# EAGLE board OpenROV Controller 2.8 (EAGLE 6.4), part 1 of 2
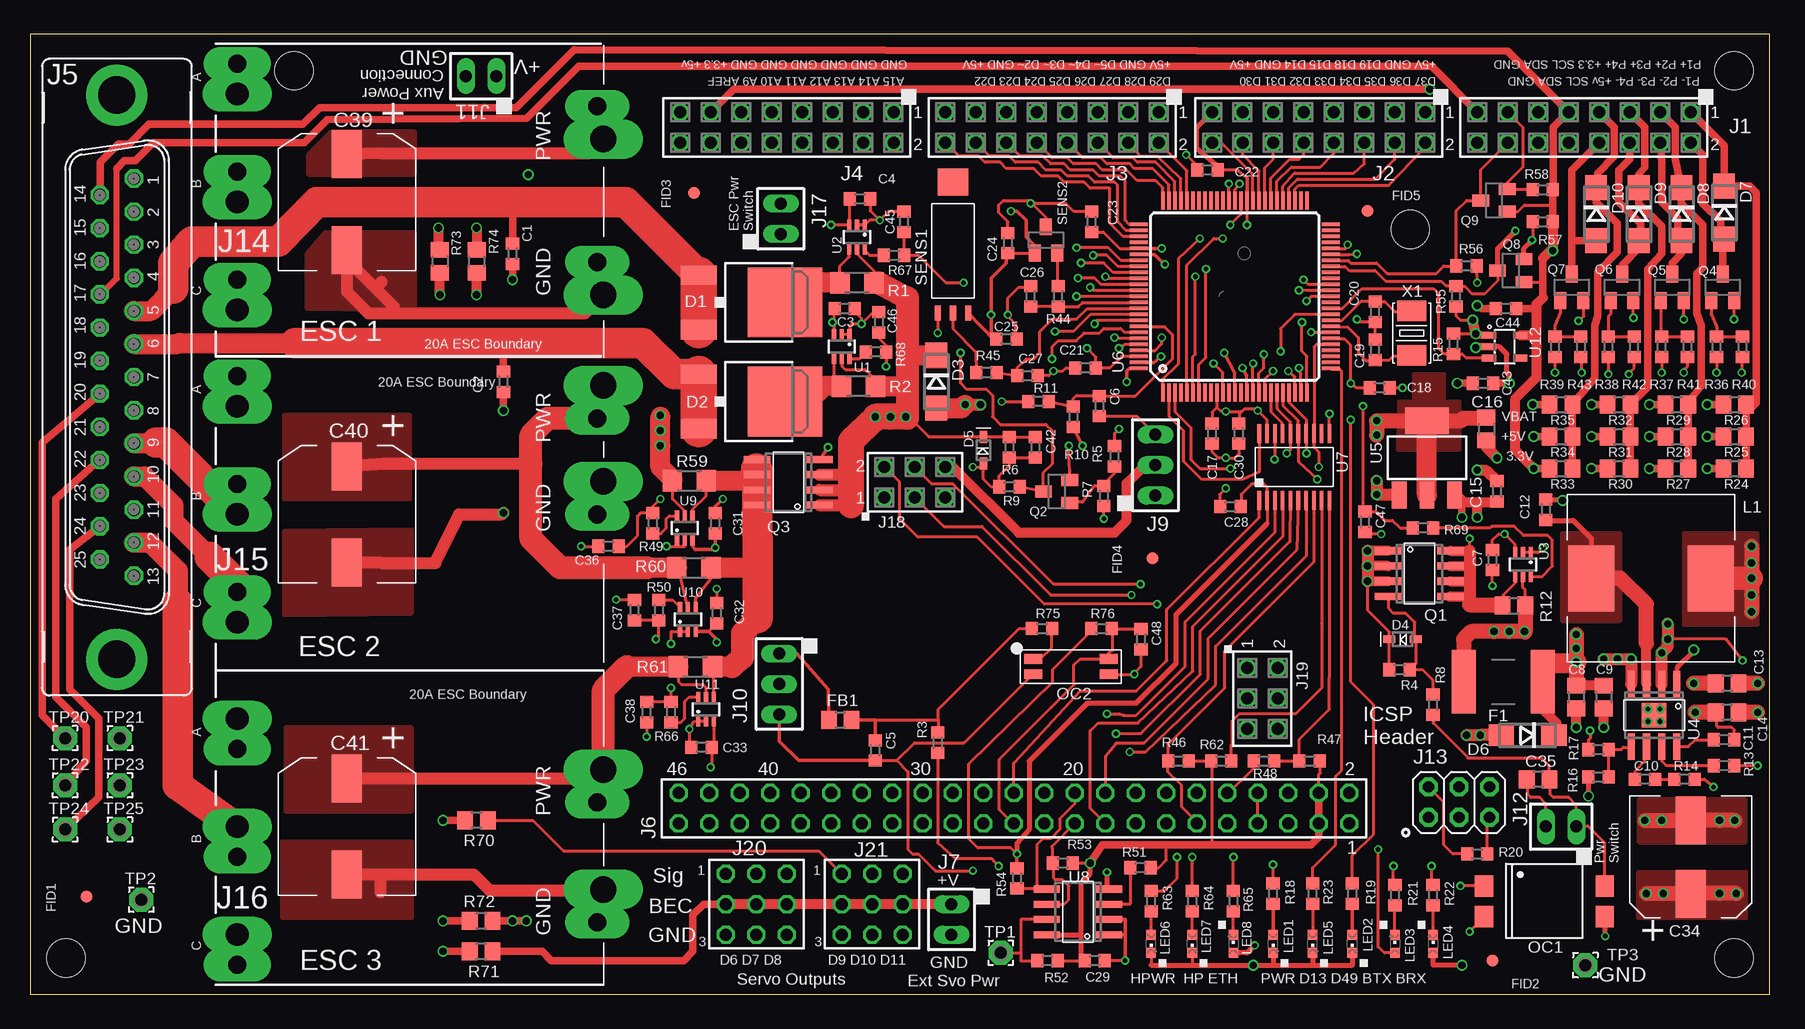
[diagram p8: board, top side]
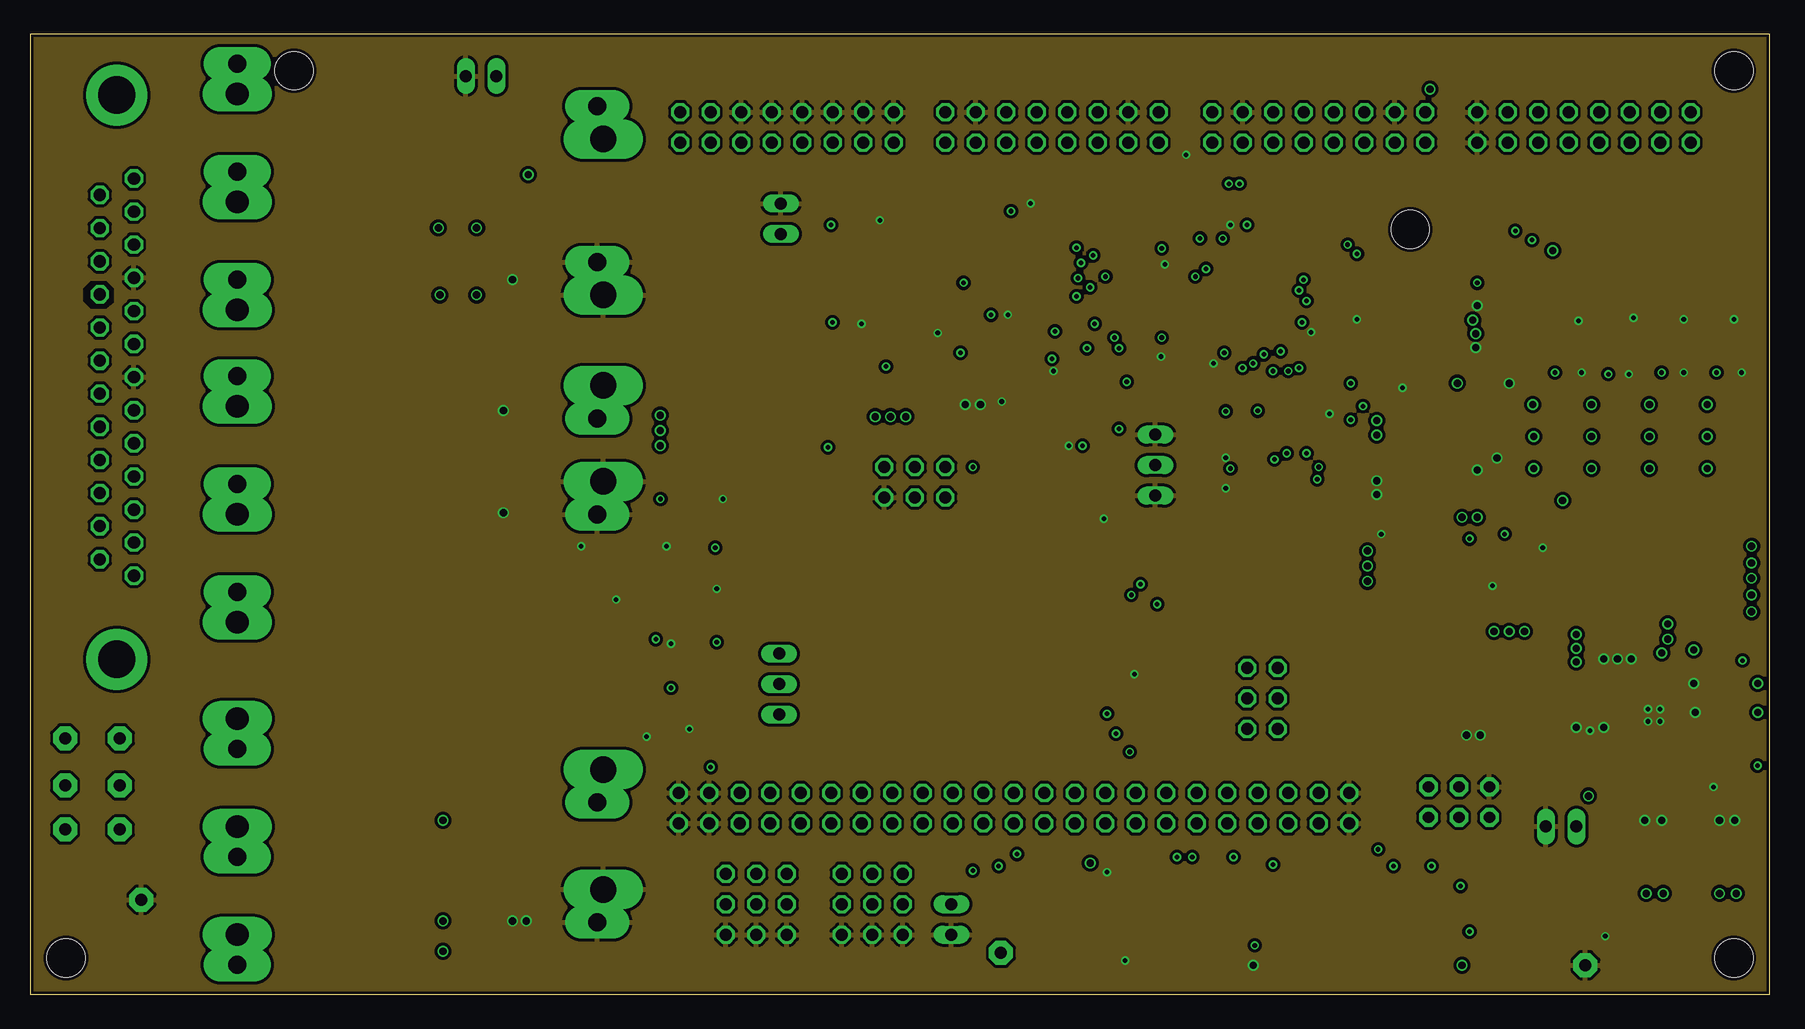
[diagram p9: board, inner layer Route2]
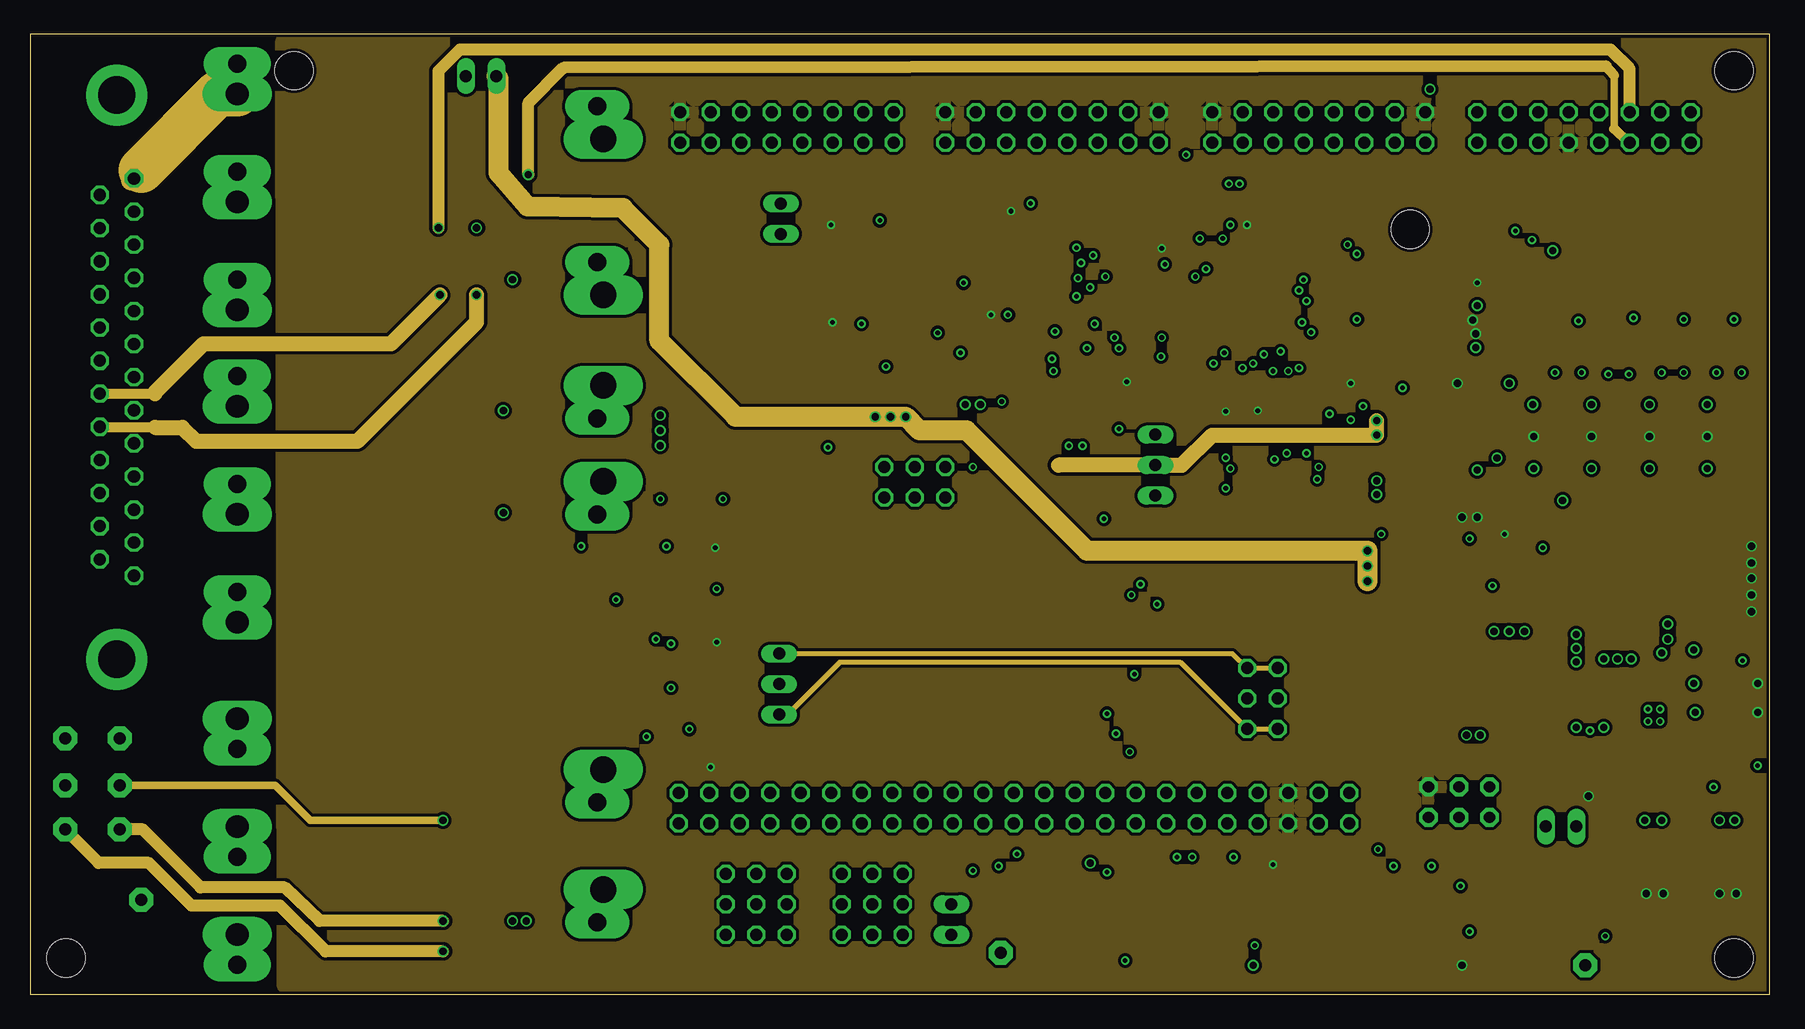
[diagram p10: board, inner layer Route15]
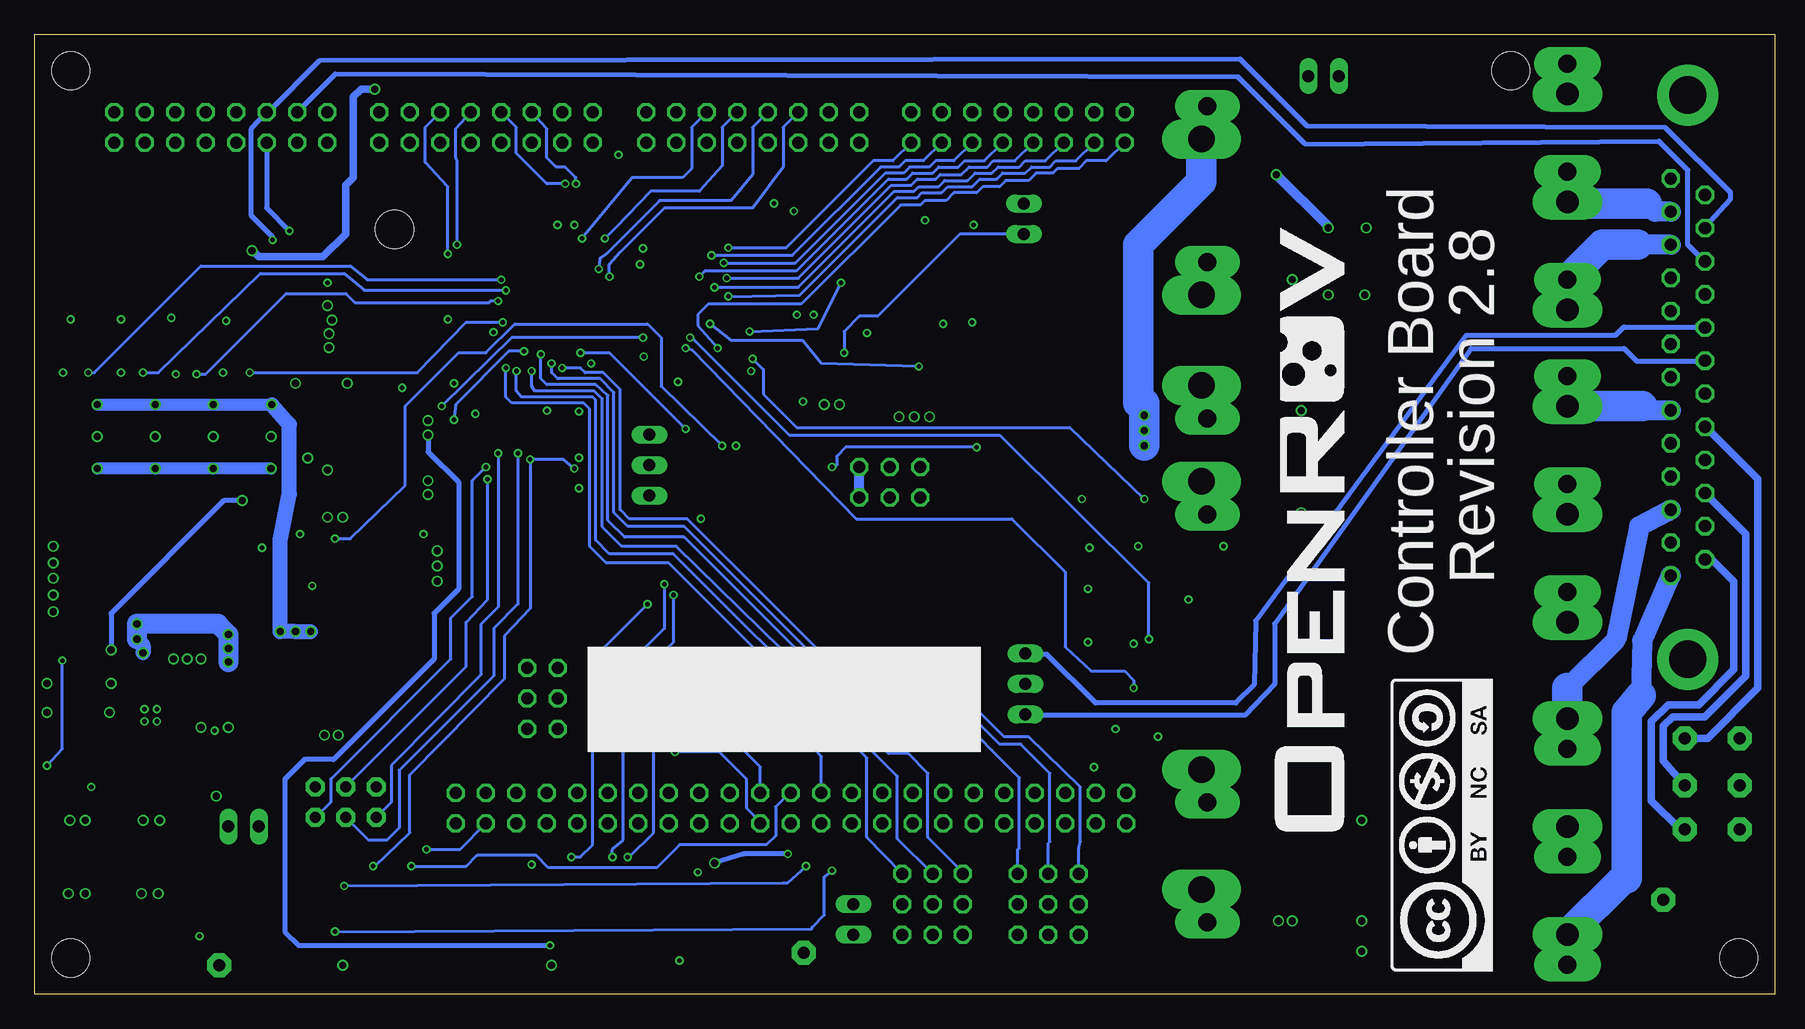
[diagram p11: board, bottom side, seen from below]

Size 144.99 x 80.01 mm. Coordinates in mm from the lower left corner, seen from the top.
Outline: 0,0 144.99,0 144.99,80.01 0,80.01 0,0
Copper layers (1*2*15*16): Top 0.035mm / dielectric 0.2mm / Route2 0.0175mm / dielectric 1.1mm / Route15 0.0175mm / dielectric 0.2mm / Bottom 0.035mm
Design rules "SeeedStudio_DRU_no_angle_20130527": minimum track width 6mil, minimum drill 12mil, track to track 6mil, track to pad 6mil, pad to pad 6mil, via to via 6mil, smd to smd 0mil, copper to edge 10mil, drill to drill 10mil, minimum pad ring 6mil, minimum via ring 6mil, stop-mask expansion 2mil, vias tented up to drill 25mil, thermal gap 10mil
Holes 3.17 mm at 3,3 141.99,3 115.02,63.75 141.99,76.99 22,76.99
tKeepout: area 139.2,0.2 to 144.8,5.8; area 139.2,74.2 to 144.8,79.8; area 19.2,74.2 to 24.8,79.8; area 112.2,61 to 117.8,66.5

## Footprints (pad centres in the part's own frame; a part is rotated, then mirrored left to right if it is on the bottom)
R0603 = smd 1 x 1.1: 1 -0.85,0; 2 0.85,0
R0805 = smd 1.3 x 1.5: 1 -0.95,0; 2 0.95,0
NICHICON_8MM = smd 4 x 2.5: + 3.05,0; - -3.05,0
NICHICON_10MM = smd 4 x 2.5: + 4,0; - -4,0
DPAK = smd 1.6 x 3: 1 -2.28,-4.04; 3 2.28,-4.04 | smd 5.8 x 6.2: 4 0,3.14
DO214AC = smd 2.1 x 1.8: A 2.2,0; C -2.2,0
SOD323 = smd 1 x 0.6: A 1.1,0; C -1.1,0
R2920 = smd 2 x 5.3: 1 -3.3,0; 2 3.3,0
FIDUCIAL_1 = smd 1.016 x 1.016: P$1 0,0
SSW-108-02-S-D = drill 1 pad 1.5 octagon: 1 -8.89,-1.27; 2 -8.89,1.27; 3 -6.35,-1.27; 4 -6.35,1.27; 5 -3.81,-1.27; 6 -3.81,1.27; 7 -1.27,-1.27; 8 -1.27,1.27; 9 1.27,-1.27; 10 1.27,1.27; 11 3.81,-1.27; 12 3.81,1.27; 13 6.35,-1.27; 14 6.35,1.27; 15 8.89,-1.27; 16 8.89,1.27
M25VP = drill 1.016 octagon: 1 -16.561,1.422; 2 -13.792,1.422; 3 -11.049,1.422; 4 -8.28,1.422; 5 -5.512,1.422; 6 -2.769,1.422; 7 0,1.422; 8 2.769,1.422; 9 5.512,1.422; 10 8.28,1.422; 11 11.049,1.422; 12 13.792,1.422; 13 16.561,1.422; 14 -15.189,-1.422; 15 -12.421,-1.422; 16 -9.652,-1.422; 17 -6.909,-1.422; 18 -4.14,-1.422; 19 -1.372,-1.422; 20 1.372,-1.422; 21 4.14,-1.422; 22 6.909,-1.422; 23 9.652,-1.422; 24 12.421,-1.422; 25 15.189,-1.422 | drill 3.1 pad 5.08: G1 -23.52,0; G2 23.52,0
TSW-123-02-S-D = drill 1 pad 1.5 octagon: 1 27.94,-1.27; 2 27.94,1.27; 3 25.4,-1.27; 4 25.4,1.27; 5 22.86,-1.27; 6 22.86,1.27; 7 20.32,-1.27; 8 20.32,1.27; 9 17.78,-1.27; 10 17.78,1.27; 11 15.24,-1.27; 12 15.24,1.27; 13 12.7,-1.27; 14 12.7,1.27; 15 10.16,-1.27; 16 10.16,1.27; 17 7.62,-1.27; 18 7.62,1.27; 19 5.08,-1.27; 20 5.08,1.27; 21 2.54,-1.27; 22 2.54,1.27; 23 0,-1.27; 24 0,1.27; 25 -2.54,-1.27; 26 -2.54,1.27; 27 -5.08,-1.27; 28 -5.08,1.27; 29 -7.62,-1.27; 30 -7.62,1.27; 31 -10.16,-1.27; 32 -10.16,1.27; 33 -12.7,-1.27; 34 -12.7,1.27; 35 -15.24,-1.27; 36 -15.24,1.27; 37 -17.78,-1.27; 38 -17.78,1.27; 39 -20.32,-1.27; 40 -20.32,1.27; 41 -22.86,-1.27; 42 -22.86,1.27; 43 -25.4,-1.27; 44 -25.4,1.27; 45 -27.94,-1.27; 46 -27.94,1.27
22-23-2021_ALT_SILK = drill 1 long: 1 -1.27,0; 2 1.27,0
22-23-2031_ALT_SILK = drill 1 long: 1 -2.54,0; 2 0,0; 3 2.54,0
HDR_PINS_2X3 = drill 0.95 pad 1.55 octagon: 1 -2.54,-1.27; 2 -2.54,1.27; 3 0,-1.27; 4 0,1.27; 5 2.54,-1.27; 6 2.54,1.27
AFRO-ESC-12/20A-ESC1S = drill 1.9 pad 2.9 long: A1 9,0; B1 0,0; C1 -9,0 | drill 1.5 pad 2.8 long: A2 11.54,0; B2 2.54,0; C2 -6.46,0 | drill 2.2 pad 3.3 long: GND1 -7.75,-30.5; PWR1 5.25,-30.5 | drill 1.5 pad 2.7 long: GND2 -5,-30; PWR2 8,-30
AFRO-ESC-12/20A-ESC2S = drill 1.9 pad 2.9 long: A1 9,0; B1 0,0; C1 -9,0 | drill 1.5 pad 2.8 long: A2 11.54,0; B2 2.54,0; C2 -6.46,0 | drill 2.2 pad 3.3 long: GND1 2.75,-30.5; PWR1 10.75,-30.5 | drill 1.5 pad 2.7 long: GND2 0,-30; PWR2 8,-30
AFRO-ESC-12/20A-ESC3S = drill 1.9 pad 2.9 long: A1 9,0; B1 0,0; C1 -9,0 | drill 1.5 pad 2.8 long: A2 6.46,0; B2 -2.54,0; C2 -11.54,0 | drill 2.2 pad 3.3 long: GND1 -5.25,-30.5; PWR1 4.75,-30.5 | drill 1.5 pad 2.7 long: GND2 -8,-30; PWR2 2,-30
SSW-103-02-S-D = drill 1 pad 1.5 octagon: 1 -2.54,-1.27; 2 -2.54,1.27; 3 0,-1.27; 4 0,1.27; 5 2.54,-1.27; 6 2.54,1.27
HDR_PINS_3X3 = drill 1 pad 1.5 octagon: P1 2.54,-2.54; P2 2.54,0; P3 2.54,2.54; P4 0,-2.54; P5 0,0; P6 0,2.54; P7 -2.54,-2.54; P8 -2.54,0; P9 -2.54,2.54
INDUCTOR_BOURNS_12X0 = smd 3.85 x 5.5: 1 -4.975,0; 2 4.975,0
LED_CHIPLED_0603 = smd 0.8 x 0.8: A 0,-0.75; C 0,0.75
DIL4-SMD = smd 1.78 x 1.52: 1 -2.54,-5.029; 2 0,-5.029; 3 0,5.029; 4 -2.54,5.029
OPTOCOUPLER-MINIFLAT-HALFPITCH = smd 1.5 x 0.8: 1 -3.15,0.635; 2 -3.15,-0.635; 3 3.15,-0.635; 4 3.15,0.635
SO8 = smd 0.6 x 2.2: 1 -1.905,-2.6; 2 -0.635,-2.6; 3 0.635,-2.6; 4 1.905,-2.6; 5 1.905,2.6; 6 0.635,2.6; 7 -0.635,2.6; 8 -1.905,2.6
SOT23 = smd 1 x 1.4: 1 -0.95,-1.1; 2 0.95,-1.1; 3 0,1.1
R1206 = smd 1.6 x 1.803: 1 -1.422,0; 2 1.422,0
HIH-5031 = smd 0.508 x 1.27: 1 -1.27,0; 2 0,0; 3 1.27,0 | smd 2.54 x 2.286: PAD 0,10.922
2.0/1.0 = drill 1 pad 2 octagon: 1 0,0
SC70-6L = smd 0.35 x 0.9: 1 -0.65,-1; 2 0,-1; 3 0.65,-1; 4 0.65,1; 5 0,1; 6 -0.65,1
SO8-THERMAL = smd 0.6 x 2.2: 1 -1.905,-2.6; 2 -0.635,-2.6; 3 0.635,-2.6; 4 1.905,-2.6; 5 1.905,2.6; 6 0.635,2.6; 7 -0.635,2.6; 8 -1.905,2.6 | smd 2.032 x 2.032: PAD 0,0
SOT223 = smd 1.219 x 2.235: 1 -2.311,-3.099; 2 0,-3.099; 3 2.311,-3.099 | smd 3.6 x 2.2: 4 0,3.099
SMARTPRJ_TQFP100 = smd 1.5 x 0.3: 1 -8,6; 2 -8,5.5; 3 -8,5; 4 -8,4.5; 5 -8,4; 6 -8,3.5; 7 -8,3; 8 -8,2.5; 9 -8,2; 10 -8,1.5; 11 -8,1; 12 -8,0.5; 13 -8,0; 14 -8,-0.5; 15 -8,-1; 16 -8,-1.5; 17 -8,-2; 18 -8,-2.5; 19 -8,-3; 20 -8,-3.5; 21 -8,-4; 22 -8,-4.5; 23 -8,-5; 24 -8,-5.5; 25 -8,-6; 51 8,-6; 52 8,-5.5; 53 8,-5; 54 8,-4.5; 55 8,-4; 56 8,-3.5; 57 8,-3; 58 8,-2.5; 59 8,-2; 60 8,-1.5; 61 8,-1; 62 8,-0.5; 63 8,0; 64 8,0.5; 65 8,1; 66 8,1.5; 67 8,2; 68 8,2.5; 69 8,3; 70 8,3.5; 71 8,4; 72 8,4.5; 73 8,5; 74 8,5.5; 75 8,6 | smd 0.3 x 1.5: 26 -6,-8; 27 -5.5,-8; 28 -5,-8; 29 -4.5,-8; 30 -4,-8; 31 -3.5,-8; 32 -3,-8; 33 -2.5,-8; 34 -2,-8; 35 -1.5,-8; 36 -1,-8; 37 -0.5,-8; 38 0,-8; 39 0.5,-8; 40 1,-8; 41 1.5,-8; 42 2,-8; 43 2.5,-8; 44 3,-8; 45 3.5,-8; 46 4,-8; 47 4.5,-8; 48 5,-8; 49 5.5,-8; 50 6,-8; 76 6,8; 77 5.5,8; 78 5,8; 79 4.5,8; 80 4,8; 81 3.5,8; 82 3,8; 83 2.5,8; 84 2,8; 85 1.5,8; 86 1,8; 87 0.5,8; 88 0,8; 89 -0.5,8; 90 -1,8; 91 -1.5,8; 92 -2,8; 93 -2.5,8; 94 -3,8; 95 -3.5,8; 96 -4,8; 97 -4.5,8; 98 -5,8; 99 -5.5,8; 100 -6,8
SSOP-20 = smd 0.3 x 1.6: 1 -2.925,-2.8; 2 -2.275,-2.8; 3 -1.625,-2.8; 4 -0.975,-2.8; 5 -0.325,-2.8; 6 0.325,-2.8; 7 0.975,-2.8; 8 1.625,-2.8; 9 2.275,-2.8; 10 2.925,-2.8; 11 2.925,2.8; 12 2.275,2.8; 13 1.625,2.8; 14 0.975,2.8; 15 0.325,2.8; 16 -0.325,2.8; 17 -0.975,2.8; 18 -1.625,2.8; 19 -2.275,2.8; 20 -2.925,2.8
SOT23-5L = smd 0.55 x 1.2: 1 -0.95,-1.3; 2 0,-1.3; 3 0.95,-1.3; 4 0.95,1.3; 5 -0.95,1.3
DISCRETE_2P-SMD-5X3.2 = smd 1.7 x 2.4: 1 -1.85,0; 2 1.85,0

## Placement (x,y rotation side)
C1  0.1 uF  [R0603]  40.21,61.72 270 top
C2  0.1 uF  [R0603]  39.45,51.05 270 top
C3  0.1 uF  [R0603]  67.9,57.15 0 top
C4  0.1 uF  [R0603]  69.17,66.29 0 top
C5  0.1 uF  [R0603]  70.44,20.32 270 top
C6  0.1 uF  [R0603]  89.11,49.02 270 top
C7  0.1 uF  [R0603]  121.87,36.2 270 top
C8  10 uF 25V X5R  [R0805]  128.86,24.77 270 top
C9  10 uF 25V X5R  [R0805]  131.14,24.77 270 top
C10  3900 pF 25V NP0  [R0603]  134.57,17.91 0 top
C11  3900 pF 25V NP0  [R0603]  141.18,21.21 0 top
C12  0.1 uF  [R0603]  126.32,40.39 270 top
C13  22 uF 10V X5R  [R0805]  141.43,25.91 180 top
C14  22 uF 10V X5R  [R0805]  141.43,23.5 180 top
C15  0.1 uF  [R0603]  122.25,41.91 90 top
C16  10 uF 25V X5R  [R0805]  121.36,47.12 270 top
C17  0.1 uF  [R0603]  98.5,46.74 270 top
C18  0.1 uF  [R0603]  112.47,50.55 0 top
C19  12 pF  [R0603]  112.09,53.72 90 top
C20  12 pF  [R0603]  112.09,56.9 270 top
C21  0.1 uF  [R0603]  87.96,52.2 180 top
C22  0.1 uF  [R0603]  98.12,68.71 180 top
C23  0.1 uF  [R0603]  88.47,64.39 90 top
C24  0.1 uF  [R0603]  81.49,62.61 90 top
C25  0.1 uF  [R0603]  81.36,54.61 0 top
C26  0.1 uF  [R0603]  83.39,58.17 90 top
C27  0.1 uF  [R0603]  83.14,51.56 0 top
C28  0.1 uF  [R0603]  100.03,40.64 180 top
C29  0.1 uF  [R0603]  88.73,2.79 0 top
C30  0.1 uF  [R0603]  100.73,46.74 270 top
C31  0.1 uF  [R0603]  57.1,39.24 90 top
C32  0.1 uF  [R0603]  57.23,31.75 90 top
C33  0.1 uF  [R0603]  55.96,20.57 180 top
C34  220 uF 10V  [NICHICON_8MM]  138.38,11.43 270 top
C35  10 uF 25V X5R  [R0805]  125.68,17.91 180 top
C36  1 uF 25V X7R  [R0603]  48.21,37.34 180 top
C37  1 uF 25V X7R  [R0603]  50.37,32 90 top
C38  1 uF 25V X7R  [R0603]  51.39,23.5 270 top
C39  220 uF 35V Low-Impedance  [NICHICON_10MM]  26.42,66.04 90 top
C40  220 uF 35V Low-Impedance  [NICHICON_10MM]  26.42,40.01 90 top
C41  220 uF 35V Low-Impedance  [NICHICON_10MM]  26.42,13.97 90 top
C42  1 uF 25V X7R  [R0603]  83.77,45.59 270 top
C43  0.1 uF  [R0603]  121.08,50.93 0 top
C44  1 uF 25V X7R  [R0603]  123.02,57.15 180 top
C45  1 uF 25V X7R  [R0603]  72.83,64.39 90 top
C46  1 uF 25V X7R  [R0603]  70.74,56.01 90 top
C47  1 uF 25V X7R  [R0603]  111.25,39.37 270 top
C48  1 uF 25V X7R  [R0603]  92.58,29.59 270 top
D1  MBRD835L  [DPAK]  59.77,57.66 270 top
D2  MBRD835L  [DPAK]  59.77,49.4 270 top
D3  SMAJ18A  [DO214AC]  75.52,51.05 270 top
D4  16.18V 2%  [SOD323]  114.38,29.59 0 top
D5  16.18V 2%  [SOD323]  79.45,45.34 270 top
D6  SMAJ15A  [DO214AC]  124.79,21.59 180 top
D7  S1A  [DO214AC]  141.18,65.15 270 top
D8  S1A  [DO214AC]  137.62,65.02 270 top
D9  S1A  [DO214AC]  134.06,65.02 270 top
D10  S1A  [DO214AC]  130.51,65.02 270 top
F1  2.0A / 4.0A 24V  [R2920]  122.76,26.04 0 top
FB1  HZ0805B272R-10  [R0805]  67.52,22.86 0 top
FID1  FIDUCIAL_1  [FIDUCIAL_1]  4.7,8.13 0 top
FID2  FIDUCIAL_1  [FIDUCIAL_1]  121.87,2.79 0 top
FID3  FIDUCIAL_1  [FIDUCIAL_1]  55.33,66.8 0 top
FID4  FIDUCIAL_1  [FIDUCIAL_1]  93.55,36.32 0 top
FID5  FIDUCIAL_1  [FIDUCIAL_1]  111.46,65.28 0 top
J1  Sullins PPPC082LFBN-RC  [SSW-108-02-S-D]  129.49,72.26 180 top
J2  PPPC082LFBN-RC (Not populated)  [SSW-108-02-S-D]  107.39,72.26 180 top
J3  PPPC082LFBN-RC (Not populated)  [SSW-108-02-S-D]  85.17,72.26 180 top
J4  PPPC082LFBN-RC (Not populated)  [SSW-108-02-S-D]  63.07,72.26 180 top
J5  Norcomp 182-025-113R531  [M25VP]  7.24,51.44 270 top
J6  Samtec DW-23-11-G-D-630  [TSW-123-02-S-D]  82,15.49 0 top
J7  [22-23-2021_ALT_SILK]  76.79,6.22 270 top
J9  [22-23-2031_ALT_SILK]  93.78,44.09 90 top
J10  [22-23-2031_ALT_SILK]  62.44,25.86 270 top
J11  [22-23-2021_ALT_SILK]  37.59,76.53 180 top
J12  [22-23-2021_ALT_SILK]  127.59,13.97 180 top
J13  [HDR_PINS_2X3]  119.08,16 0 top
J14  [AFRO-ESC-12/20A-ESC1S]  17.27,66.04 90 top
J15  [AFRO-ESC-12/20A-ESC2S]  17.27,40.01 90 top
J16  [AFRO-ESC-12/20A-ESC3S]  17.27,13.97 90 top
J17  [22-23-2021_ALT_SILK]  62.56,64.64 90 top
J18  Sullins PRPC003DFAN-RC  [SSW-103-02-S-D]  73.74,42.67 0 top
J19  Sullins PRPC003DFAN-RC  [SSW-103-02-S-D]  102.7,24.64 270 top
J20  TSW-103-07-G-T  [HDR_PINS_3X3]  60.53,7.49 180 top
J21  TSW-103-07-G-T  [HDR_PINS_3X3]  70.18,7.49 180 top
L1  15 uH 4A  [INDUCTOR_BOURNS_12X0]  135.08,34.67 0 top
LED1  GREEN  [LED_CHIPLED_0603]  103.58,4.19 180 top
LED2  RED  [LED_CHIPLED_0603]  110.19,4.19 180 top
LED3  YELLOW  [LED_CHIPLED_0603]  113.75,4.19 0 top
LED4  YELLOW  [LED_CHIPLED_0603]  116.92,4.19 0 top
LED5  RED  [LED_CHIPLED_0603]  106.89,4.19 180 top
LED6  GREEN  [LED_CHIPLED_0603]  93.42,4.19 180 top
LED7  YELLOW  [LED_CHIPLED_0603]  96.85,4.19 180 top
LED8  YELLOW  [LED_CHIPLED_0603]  100.28,4.19 0 top
OC1  LTV-8141S  [DIL4-SMD]  126.19,6.48 270 top
OC2  PC3H411NIP0F  [OPTOCOUPLER-MINIFLAT-HALFPITCH]  86.74,27.3 0 top
Q1  SI4485  [SO8]  115.78,35.05 270 top
Q2  DMN65D8L  [SOT23]  85.55,41.91 90 top
Q3  SI4459ADY  [SO8]  63.2,42.67 90 top
Q4  IRLML6346TR  [SOT23]  141.05,58.93 0 top
Q5  IRLML6346TR  [SOT23]  136.86,58.93 0 top
Q6  IRLML6346TR  [SOT23]  132.67,58.93 0 top
Q7  IRLML6346TR  [SOT23]  128.48,58.93 0 top
Q8  FDV301N  [SOT23]  123.4,60.33 90 top
Q9  FDV301N  [SOT23]  122,66.17 90 top
R1  0.005 1%  [R1206]  68.91,59.31 0 top
R2  0.005 1%  [R1206]  69.04,50.67 0 top
R3  18K  [R0603]  75.64,20.95 90 top
R4  30.1K 1%  [R0603]  114.13,27.05 180 top
R5  1K  [R0603]  90.38,44.83 90 top
R6  10K  [R0603]  81.61,45.59 90 top
R7  10K  [R0603]  89.49,41.53 270 top
R8  1K  [R0603]  116.92,24.13 90 top
R9  1K  [R0603]  81.61,42.29 180 top
R10  30.1K 1%  [R0603]  86.95,48.13 90 top
R11  10.0K 1%  [R0603]  84.03,49.4 180 top
R12  0.025 1%  [R0805]  123.65,32.38 0 top
R13  100K  [R0603]  141.18,19.05 180 top
R14  13.0K 1%  [R0603]  137.88,17.91 180 top
R15  10K  [R0603]  118.62,54.23 90 top
R16  45.3K 1%  [R0603]  130.7,18.1 180 top
R17  10.0K 1%  [R0603]  130.7,20.38 0 top
R18  1K  [R0603]  103.58,8.38 270 top
R19  1K  [R0603]  110.19,8.38 270 top
R20  100K  [R0603]  120.6,11.68 0 top
R21  470  [R0603]  113.75,8.26 90 top
R22  1K  [R0603]  116.92,8.26 90 top
R23  1K  [R0603]  106.89,8.38 270 top
R24  DNP  [R0805]  142.07,43.81 0 top
R25  DNP  [R0805]  142.07,46.48 0 top
R26  0 (Jumper)  [R0805]  142.07,49.15 0 top
R27  DNP  [R0805]  137.24,43.81 0 top
R28  0 (Jumper)  [R0805]  137.24,46.48 0 top
R29  DNP  [R0805]  137.24,49.15 0 top
R30  DNP  [R0805]  132.41,43.81 0 top
R31  DNP  [R0805]  132.41,46.48 0 top
R32  0 (Jumper)  [R0805]  132.41,49.15 0 top
R33  DNP  [R0805]  127.59,43.81 0 top
R34  DNP  [R0805]  127.59,46.48 0 top
R35  DNP  [R0805]  127.59,49.15 0 top
R36  1K  [R0603]  140.54,53.98 90 top
R37  1K  [R0603]  135.97,53.98 90 top
R38  1K  [R0603]  131.53,53.98 90 top
R39  1K  [R0603]  127.08,53.98 90 top
R40  10K  [R0603]  142.7,53.98 90 top
R41  10K  [R0603]  138.13,53.98 90 top
R42  10K  [R0603]  133.68,53.98 90 top
R43  10K  [R0603]  129.24,53.98 90 top
R44  10K  [R0603]  85.68,58.17 270 top
R45  10K  [R0603]  79.71,51.82 0 top
R46  1K  [R0603]  95.71,19.43 0 top
R47  DNP  [R0603]  106.63,19.43 0 top
R48  0 (Jumper)  [R0603]  102.82,19.43 180 top
R49  3.3K  [R0603]  51.9,39.24 90 top
R50  3.3K  [R0603]  52.4,32 270 top
R51  4.7K  [R0603]  92.54,10.54 0 top
R52  4.7K  [R0603]  84.79,2.79 0 top
R53  4.7K  [R0603]  86.06,10.92 0 top
R54  4.7K  [R0603]  82.25,9.65 90 top
R55  4.7K  [R0603]  118.83,58.17 270 top
R56  4.7K  [R0603]  119.71,60.71 0 top
R57  4.7K  [R0603]  126.06,64.39 0 top
R58  4.7K  [R0603]  126.06,67.06 0 top
R59  0.005 1%  [R1206]  54.94,42.8 180 top
R60  0.005 1%  [R1206]  55.33,35.56 180 top
R61  0.005 1%  [R1206]  55.45,27.3 180 top
R62  10K  [R0603]  99.27,19.43 180 top
R63  120  [R0603]  93.42,7.75 90 top
R64  120  [R0603]  96.85,7.75 90 top
R65  330  [R0603]  100.28,7.75 90 top
R66  3.3K  [R0603]  53.42,23.5 90 top
R67  3.3K  [R0603]  72.01,61.59 0 top
R68  3.3K  [R0603]  70.48,53.53 0 top
R69  3.3K  [R0603]  116.08,38.86 180 top
R70  0 (Jumper)  [R0805]  37.21,14.48 180 top
R71  0 (Jumper)  [R0805]  37.59,3.56 180 top
R72  0 (Jumper)  [R0805]  37.59,6.1 180 top
R73  0 (Jumper)  [R0805]  34.16,61.09 270 top
R74  0 (Jumper)  [R0805]  37.21,61.09 270 top
R75  10K  [R0603]  84.33,30.48 180 top
R76  30.1K 1%  [R0603]  89.28,30.48 180 top
SENS1  HIH-5031  [HIH-5031]  76.92,56.77 0 top
SENS2  MCP9701A  [SOT23]  84.66,62.87 0 top
TP1  [2.0/1.0]  80.9,3.43 0 top
TP2  [2.0/1.0]  9.27,7.87 0 top
TP3  [2.0/1.0]  129.62,2.41 0 top
TP20  [2.0/1.0]  2.92,21.34 0 top
TP21  [2.0/1.0]  7.49,21.34 0 top
TP22  [2.0/1.0]  2.92,17.4 0 top
TP23  [2.0/1.0]  7.49,17.4 0 top
TP24  [2.0/1.0]  2.92,13.72 0 top
TP25  [2.0/1.0]  7.49,13.72 0 top
U1  INA199A2  [SC70-6L]  67.64,53.98 180 top
U2  INA199A2  [SC70-6L]  68.91,63.12 180 top
U3  INA199A2  [SC70-6L]  124.41,35.81 180 top
U4  Richtek RT8250  [SO8-THERMAL]  135.34,23.24 180 top
U5  TLV1117LV33DCY  [SOT223]  116.41,44.7 0 top
U6  ATMEGA2560-16AU  [SMARTPRJ_TQFP100]  100.41,58.17 90 top
U7  TXB0108SSOP-20  [SSOP-20]  105.36,43.94 0 top
U8  CAT24C256WI-G  [SO8]  87.33,6.86 90 top
U9  INA199A2  [SC70-6L]  54.56,38.86 0 top
U10  INA199A2  [SC70-6L]  54.82,31.24 0 top
U11  INA199A2  [SC70-6L]  56.34,23.75 0 top
U12  TCR2EF33  [SOT23-5L]  122.89,53.98 270 top
U$1  [OROV-LOGO-2.00]  34.12,12.95 90 bottom
U$2  [CC-LOGO-1]  23.5,1.91 90 bottom
X1  16 MHz  [DISCRETE_2P-SMD-5X3.2]  115.14,55.12 270 top